# Altium schematic sheet 04.SchDoc
size 420 x 297 mm
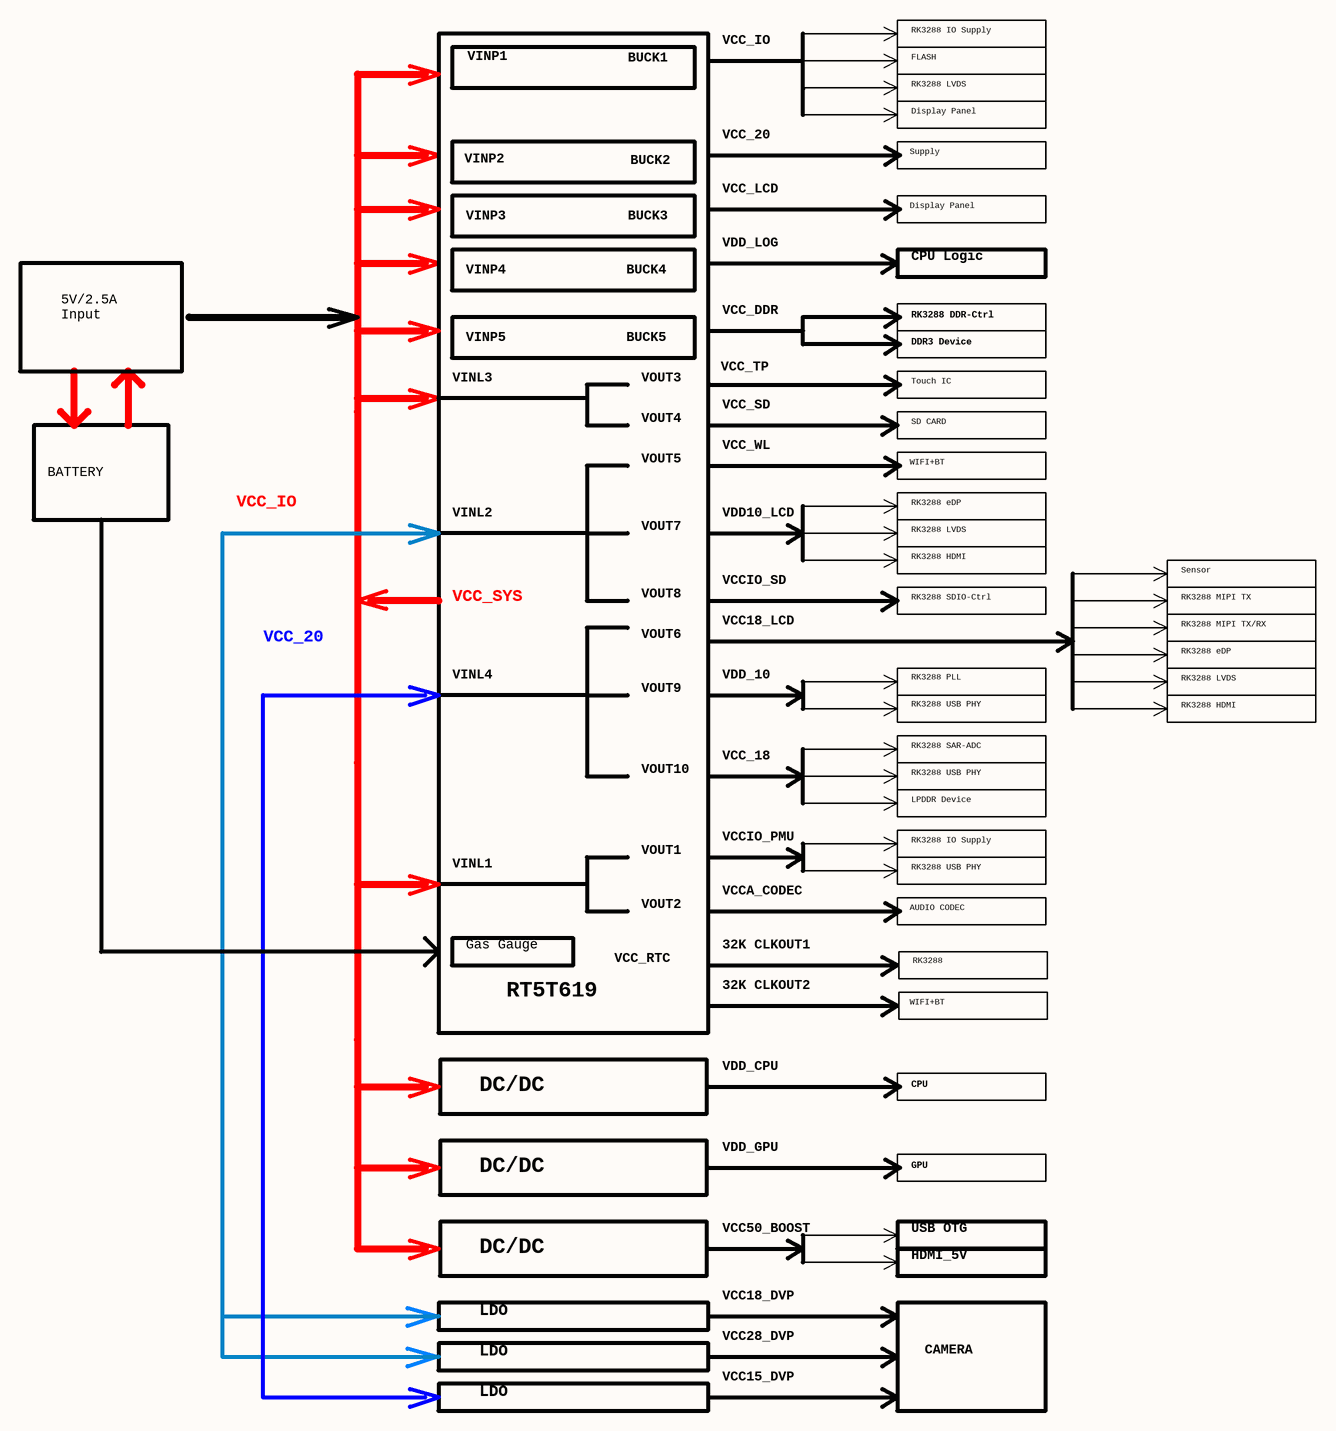
[diagram p0: 04.SchDoc]

## Notes on the sheet
- VINP1
- BUCK1
- VCC_IO
- RK3288 IO Supply
- FLASH
- VCC_20
- RK3288 LVDS
- Display Panel
- VINP2
- BUCK2
- VCC_LCD
- Supply
- VINP4
- VINP3
- BUCK4
- BUCK3
- VDD_LOG
- CPU Logic
- 5V/2.5A
  Input
- VINP5
- BUCK5
- VCC_DDR
- RK3288 DDR-Ctrl
- DDR3 Device
- VINL3
- VOUT3
- VCC_TP
- VCC_SD
- Touch IC
- BATTERY
- VOUT4
- VOUT5
- VCC_WL
- WIFI+BT
- SD CARD
- VINL2
- VOUT7
- VDD10_LCD
- RK3288 eDP
- VCC_SYS
- VOUT8
- VCCIO_SD
- RK3288 HDMI
- RK3288 SDIO-Ctrl
- RK3288 MIPI TX
- Sensor
- VINL4
- VOUT6
- VCC18_LCD
- VDD_10
- RK3288 PLL
- RK3288 MIPI TX/RX
- VOUT9
- RK3288 SAR-ADC
- RK3288 USB PHY
- VOUT10
- VCC_18
- LPDDR Device
- VINL1
- VOUT1
- VCCIO_PMU
- Gas Gauge
- VOUT2
- VCCA_CODEC
- 32K CLKOUT1
- AUDIO CODEC
- RT5T619
- VCC_RTC
- 32K CLKOUT2
- RK3288
- VDD_CPU
- CPU
- DC/DC
- VDD_GPU
- GPU
- VCC50_BOOST
- USB OTG
- HDMI_5V
- LDO
- VCC18_DVP
- VCC28_DVP
- CAMERA
- VCC15_DVP